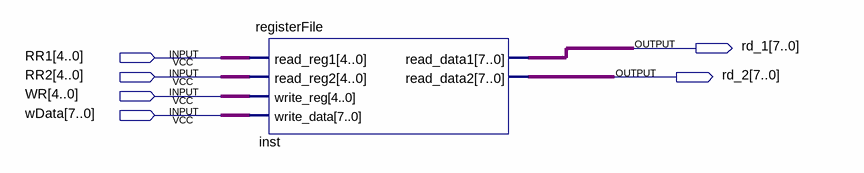
[diagram p0: schematic sheet]
// Quartus schematic testing_reg_file.bdf as structural Verilog: 1 symbols, 6 pins
module testing_reg_file (
  input  [4:0] RR1,
  input  [4:0] RR2,
  input  [4:0] WR,
  input  [7:0] wData,
  output [7:0] rd_1,
  output [7:0] rd_2
);

  registerFile inst (
    .read_reg1(RR1), .read_reg2(RR2), .write_reg(WR), .write_data(wData), .read_data1(rd_1), .read_data2(rd_2));
endmodule
